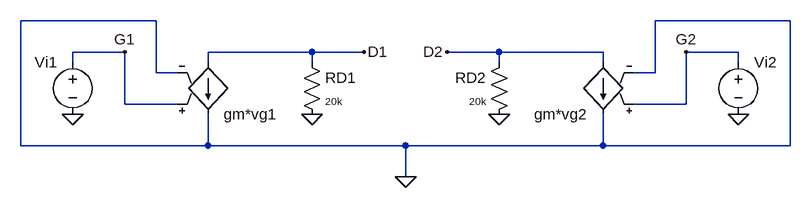
[diagram p0: schematic DifferentialAmplifierSmallSignalPi.asc]
DifferentialAmplifierSmallSignalPi.asc, the LTspice schematic file:
Version 4
SHEET 1 1156 680
WIRE 176 -400 -32 -400
WIRE 1152 -400 944 -400
WIRE 128 -352 48 -352
WIRE 416 -352 256 -352
WIRE 496 -352 416 -352
WIRE 704 -352 624 -352
WIRE 864 -352 704 -352
WIRE 1072 -352 992 -352
WIRE 48 -336 48 -352
WIRE 256 -336 256 -352
WIRE 416 -336 416 -352
WIRE 704 -336 704 -352
WIRE 864 -336 864 -352
WIRE 1072 -336 1072 -352
WIRE 176 -320 176 -400
WIRE 208 -320 176 -320
WIRE 944 -320 944 -400
WIRE 944 -320 912 -320
WIRE 128 -272 128 -352
WIRE 208 -272 128 -272
WIRE 992 -272 992 -352
WIRE 992 -272 912 -272
WIRE -32 -208 -32 -400
WIRE 256 -208 256 -256
WIRE 256 -208 -32 -208
WIRE 560 -208 256 -208
WIRE 864 -208 864 -256
WIRE 864 -208 560 -208
WIRE 1152 -208 1152 -400
WIRE 1152 -208 864 -208
WIRE 560 -160 560 -208
FLAG 48 -256 0
FLAG 1072 -256 0
FLAG 416 -256 0
FLAG 128 -352 G1
FLAG 496 -352 D1
FLAG 624 -352 D2
FLAG 704 -256 0
FLAG 992 -352 G2
FLAG 560 -160 0
SYMBOL res 400 -352 R0
WINDOW 3 36 76 Left 1
SYMATTR Value 20k
SYMATTR InstName RD1
SYMBOL voltage 1072 -352 R0
WINDOW 3 24 96 Invisible 2
SYMATTR InstName Vi2
SYMBOL voltage 48 -352 M0
WINDOW 3 24 96 Invisible 2
SYMATTR InstName Vi1
SYMBOL res 720 -352 M0
WINDOW 3 36 76 Left 1
SYMATTR Value 20k
SYMATTR InstName RD2
SYMBOL g 256 -240 M180
WINDOW 3 24 96 Invisible 2
SYMATTR InstName gm*vg1
SYMBOL g 864 -240 R180
WINDOW 3 24 96 Invisible 2
SYMATTR InstName gm*vg2

The netlist it stands for:
* DifferentialAmplifierSmallSignalPi.asc
RD1 D1 0 20k
Vi2 G2 0 V
Vi1 G1 0 V
RD2 D2 0 20k
gm*vg1 D1 0 G1 0 G
gm*vg2 D2 0 G2 0 G
.backanno
.end